# EAGLE design IR_detector_pcb (EAGLE 9.0.0)
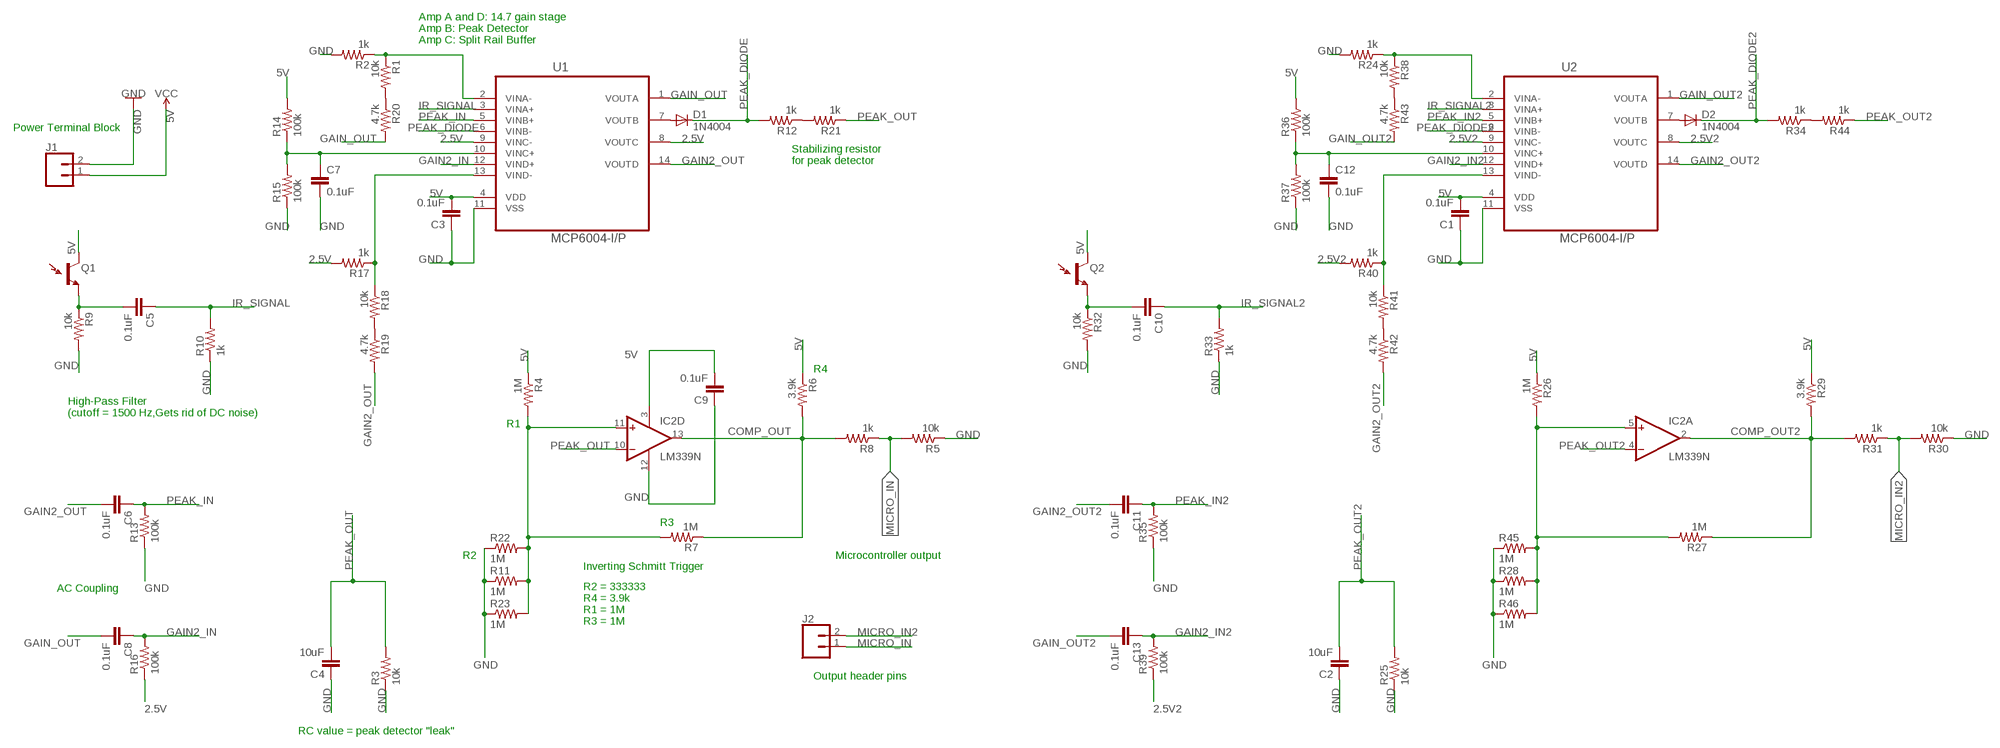
[diagram p0: schematic, sheet 1]

## Parts
C1  0.1uF  C-EU025-024X044  [C025-024X044]
C2  10uF  C-EU025-024X044  [C025-024X044]
C3  0.1uF  C-EU025-024X044  [C025-024X044]
C4  10uF  C-EU025-024X044  [C025-024X044]
C5  0.1uF  C-EU025-024X044  [C025-024X044]
C6  0.1uF  C-EU025-024X044  [C025-024X044]
C7  0.1uF  C-EU025-024X044  [C025-024X044]
C8  0.1uF  C-EU025-024X044  [C025-024X044]
C9  0.1uF  C-EU025-024X044  [C025-024X044]
C10  0.1uF  C-EU025-024X044  [C025-024X044]
C11  0.1uF  C-EU025-024X044  [C025-024X044]
C12  0.1uF  C-EU025-024X044  [C025-024X044]
C13  0.1uF  C-EU025-024X044  [C025-024X044]
D1  1N4004  [DO41-10]
D2  1N4004  [DO41-10]
IC2  LM339N  [DIL14]
J1  CONN_025MM  [SCREWTERMINAL-5MM-2]
J2  CONN_02  [1X02]
Q1  LTR-301  [LTR-301]
Q2  LTR-301  [LTR-301]
R1  10k  R-US_0204/2V  [0204V]
R2  1k  R-US_0204/2V  [0204V]
R3  10k  R-US_0204/2V  [0204V]
R4  1M  R-US_0204/2V  [0204V]
R5  10k  R-US_0204/2V  [0204V]
R6  3.9k  R-US_0204/2V  [0204V]
R7  1M  R-US_0204/2V  [0204V]
R8  1k  R-US_0204/2V  [0204V]
R9  10k  R-US_0204/2V  [0204V]
R10  1k  R-US_0204/2V  [0204V]
R11  1M  R-US_0204/2V  [0204V]
R12  1k  R-US_0204/2V  [0204V]
R13  100k  R-US_0204/2V  [0204V]
R14  100k  R-US_0204/2V  [0204V]
R15  100k  R-US_0204/2V  [0204V]
R16  100k  R-US_0204/2V  [0204V]
R17  1k  R-US_0204/2V  [0204V]
R18  10k  R-US_0204/2V  [0204V]
R19  4.7k  R-US_0204/2V  [0204V]
R20  4.7k  R-US_0204/2V  [0204V]
R21  1k  R-US_0204/2V  [0204V]
R22  1M  R-US_0204/2V  [0204V]
R23  1M  R-US_0204/2V  [0204V]
R24  1k  R-US_0204/2V  [0204V]
R25  10k  R-US_0204/2V  [0204V]
R26  1M  R-US_0204/2V  [0204V]
R27  1M  R-US_0204/2V  [0204V]
R28  1M  R-US_0204/2V  [0204V]
R29  3.9k  R-US_0204/2V  [0204V]
R30  10k  R-US_0204/2V  [0204V]
R31  1k  R-US_0204/2V  [0204V]
R32  10k  R-US_0204/2V  [0204V]
R33  1k  R-US_0204/2V  [0204V]
R34  1k  R-US_0204/2V  [0204V]
R35  100k  R-US_0204/2V  [0204V]
R36  100k  R-US_0204/2V  [0204V]
R37  100k  R-US_0204/2V  [0204V]
R38  10k  R-US_0204/2V  [0204V]
R39  100k  R-US_0204/2V  [0204V]
R40  1k  R-US_0204/2V  [0204V]
R41  10k  R-US_0204/2V  [0204V]
R42  4.7k  R-US_0204/2V  [0204V]
R43  4.7k  R-US_0204/2V  [0204V]
R44  1k  R-US_0204/2V  [0204V]
R45  1M  R-US_0204/2V  [0204V]
R46  1M  R-US_0204/2V  [0204V]
U1  MCP6004-I/P  [DIP254P762X533-14]
U2  MCP6004-I/P  [DIP254P762X533-14]

## Nets
2.5V: R16.1 R17.2 U1.8(VOUTC) U1.9(VINC-)
2.5V2: R39.1 R40.2 U2.8(VOUTC) U2.9(VINC-)
5V: C1.2 C3.2 C9.2 IC2.3(P:V+) J1.1 Q1.C(C1) Q2.C(C1) R4.1 R6.1 R14.2 R26.1 R29.1 R36.2 U1.4(VDD) U2.4(VDD) ; supply symbol labelled VCC
COMP_OUT: IC2.13(D:OUT) R6.2 R7.1 R8.2
COMP_OUT2: IC2.2(A:OUT) R27.1 R29.2 R31.2
GAIN2_IN: C8.1 R16.2 U1.12(VIND+)
GAIN2_IN2: C13.1 R39.2 U2.12(VIND+)
GAIN2_OUT: C6.2 R19.2 U1.14(VOUTD)
GAIN2_OUT2: C11.2 R42.2 U2.14(VOUTD)
GAIN_OUT: C8.2 R20.2 U1.1(VOUTA)
GAIN_OUT2: C13.2 R43.2 U2.1(VOUTA)
GND: C1.1 C2.1 C3.1 C4.1 C7.2 C9.1 C12.2 IC2.12(P:GND) J1.2 R2.2 R3.1 R5.1 R9.2 R10.1 R11.1 R13.1 R15.1 R22.1 R23.1 R24.2 R25.1 R28.1 R30.1 R32.2 R33.1 R35.1 R37.1 R45.1 R46.1 U1.11(VSS) U2.11(VSS)
IR_SIGNAL: C5.1 R10.2 U1.3(VINA+)
IR_SIGNAL2: C10.1 R33.2 U2.3(VINA+)
MICRO_IN: J2.1 R5.2 R8.1
MICRO_IN2: J2.2 R30.2 R31.1
N$1: C5.2 Q1.E(E1) R9.1
N$2: D1.A U1.7(VOUTB)
N$3: R17.1 R18.1 U1.13(VIND-)
N$4: C7.1 R14.1 R15.2 U1.10(VINC+)
N$5: R1.1 R2.1 U1.2(VINA-)
N$6: R18.2 R19.1
N$7: R1.2 R20.1
N$8: R12.1 R21.2
N$9: IC2.5(A:+IN) R26.2 R27.2 R28.2 R45.2 R46.2
N$10: C10.2 Q2.E(E1) R32.1
N$11: D2.A U2.7(VOUTB)
N$12: C12.1 R36.1 R37.2 U2.10(VINC+)
N$13: R24.1 R38.1 U2.2(VINA-)
N$14: R40.1 R41.1 U2.13(VIND-)
N$15: R41.2 R42.1
N$16: R38.2 R43.1
N$17: R34.1 R44.2
N$34: IC2.11(D:+IN) R4.2 R7.2 R11.2 R22.2 R23.2
PEAK_DIODE: D1.C R12.2 U1.6(VINB-)
PEAK_DIODE2: D2.C R34.2 U2.6(VINB-)
PEAK_IN: C6.1 R13.2 U1.5(VINB+)
PEAK_IN2: C11.1 R35.2 U2.5(VINB+)
PEAK_OUT: C4.2 IC2.10(D:-IN) R3.2 R21.1
PEAK_OUT2: C2.2 IC2.4(A:-IN) R25.2 R44.1
Unconnected: IC2.1(B:OUT) IC2.6(B:-IN) IC2.7(B:+IN) IC2.8(C:-IN) IC2.9(C:+IN) IC2.14(C:OUT)

## Notes on the sheet
- Amp A and D: 14.7 gain stage 
  Amp B: Peak Detector
  Amp C: Split Rail Buffer
- Power Terminal Block
- Stabilizing resistor 
  for peak detector
- R4
- High-Pass Filter
  (cutoff = 1500 Hz,Gets rid of DC noise)
- R1
- R3
- R2 | Microcontroller output
- Inverting Schmitt Trigger
- AC Coupling
- R2 = 333333
  R4 = 3.9k
  R1 = 1M
  R3 = 1M
- Output header pins
- RC value = peak detector "leak"

## Library data of the parts
C1-C13 = resistor:C-EU: CAPACITOR, European symbol
D1 D2 = diode:1N4004: DIODE general purpose rectifier, 1 A
IC2 = linear3:LM339: Low Power Low Offset Voltage Quad Comparators with open collector; LM139/LM239/LM339/LM2901/LM3302
J1 = SparkFun-Connectors:CONN_02: Multi connection point. Often used as Generic Header-pin footprint for 0.1 inch spaced/style header connections On any of the 0.1 inch spaced packages, you can populate with these: Break Away Headers - Straight <https://www.sparkfun.com/products/116> (PRT-00116) Break Away Male Headers - Right Angle <https://www.sparkfun.com/products/553> (PRT-00553) Female Headers <https://www.sparkfun.com/products/115> (PRT-00115) Break Away Headers - Machine Pin <https://www.sparkfun.com/products/117> (PRT-00117) Break Away Female Headers - Swiss Machine Pin <https://www.sparkfun.com/products/743> (PRT-00743) For SCREWTERMINALS and SPRING TERMINALS visit here: Screw Terimnals on SparkFun.com <https://www.sparkfun.com/search/results?term=Screw+Terminals> (5mm/3.5mm/2.54mm spacing) This device is also useful as a general connection point to wire up your design to another part of your project. Our various solder wires solder well into these plated through hole pads. Hook-Up Wire - Assortment (Stranded, 22 AWG) <https://www.sparkfun.com/products/11375> (PRT-11375) Hook-Up Wire - Assortment (Solid Core, 22 AWG) <https://www.sparkfun.com/products/11367> (PRT-11367) View the entire wire category on our website here <https://www.sparkfun.com/categories/141> Special notes: Molex polarized connector foot print use with: PRT-08233 with associated crimp pins and housings. 2.54_SCREWTERM for use with PRT-10571. 3.5mm Screw Terminal footprints for PRT-08084 5mm Screw Terminal footprints for use with PRT-08432; SF_SKU: PRT-08432
J2 = SparkFun-Connectors:CONN_02: Multi connection point. Often used as Generic Header-pin footprint for 0.1 inch spaced/style header connections On any of the 0.1 inch spaced packages, you can populate with these: Break Away Headers - Straight <https://www.sparkfun.com/products/116> (PRT-00116) Break Away Male Headers - Right Angle <https://www.sparkfun.com/products/553> (PRT-00553) Female Headers <https://www.sparkfun.com/products/115> (PRT-00115) Break Away Headers - Machine Pin <https://www.sparkfun.com/products/117> (PRT-00117) Break Away Female Headers - Swiss Machine Pin <https://www.sparkfun.com/products/743> (PRT-00743) For SCREWTERMINALS and SPRING TERMINALS visit here: Screw Terimnals on SparkFun.com <https://www.sparkfun.com/search/results?term=Screw+Terminals> (5mm/3.5mm/2.54mm spacing) This device is also useful as a general connection point to wire up your design to another part of your project. Our various solder wires solder well into these plated through hole pads. Hook-Up Wire - Assortment (Stranded, 22 AWG) <https://www.sparkfun.com/products/11375> (PRT-11375) Hook-Up Wire - Assortment (Solid Core, 22 AWG) <https://www.sparkfun.com/products/11367> (PRT-11367) View the entire wire category on our website here <https://www.sparkfun.com/categories/141> Special notes: Molex polarized connector foot print use with: PRT-08233 with associated crimp pins and housings. 2.54_SCREWTERM for use with PRT-10571. 3.5mm Screw Terminal footprints for PRT-08084 5mm Screw Terminal footprints for use with PRT-08432
Q1 Q2 = SparkFun-Sensors:LTR-301: LiteOn LTR-301 IR Phototransistor (Side-Receiving) Side-looking Infrared detectors. These simple devices operate at 940nm and work well for generic IR systems including remote control and touch-less object sensing. Using a simple ADC on any microcontroller will allow variable readings to be collected from the detector. Datasheet <http://www.sparkfun.com/datasheets/Components/LTR-301.pdf> SparkFun Products Infrared Emitters and Detectors <https://www.sparkfun.com/products/241> (SEN-00241); PROD_ID: DIO-10904; SF_ID: SEN-00241
R1-R46 = rcl:R-US_: RESISTOR, American symbol; SPICEPREFIX: R
U1 U2 = Microchip_By_element14_Batch_1:MCP6004-I/P: IC OPAMP QUAD 1.8V; MPN: MCP6004-I/P; OC_FARNELL: 1605571; OC_NEWARK: 61K2951; PACKAGE: 14DIP; SUPPLIER: Microchip

## Board
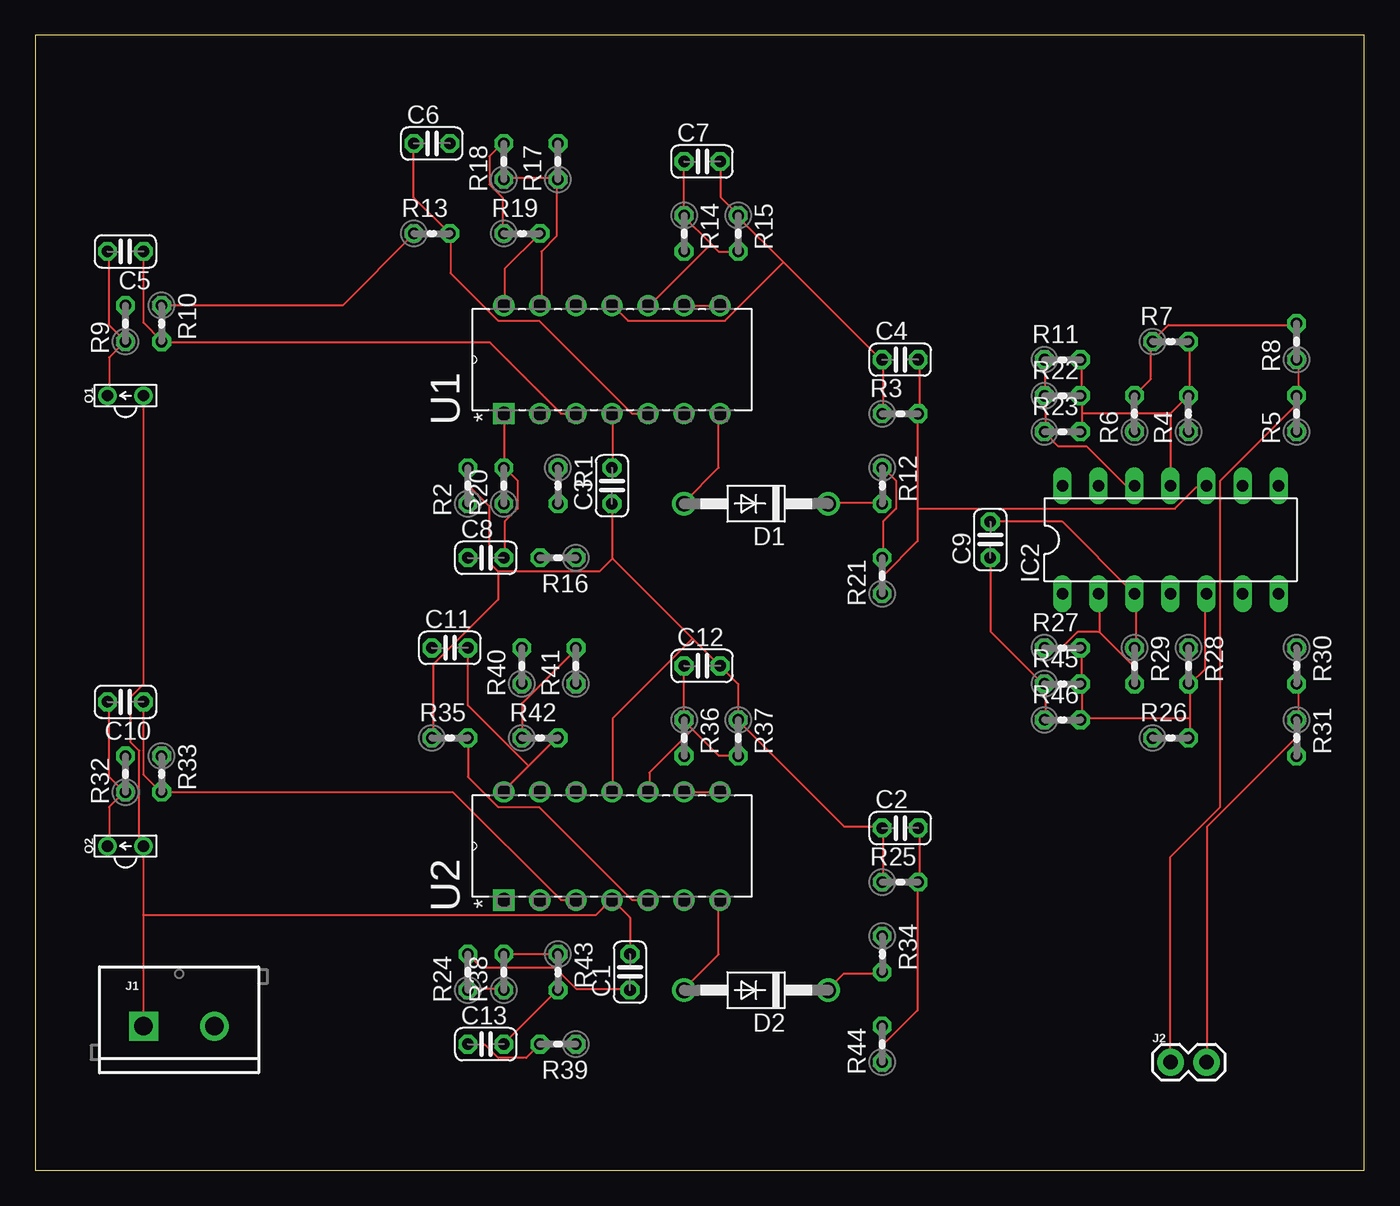
[diagram p1: board, top side]
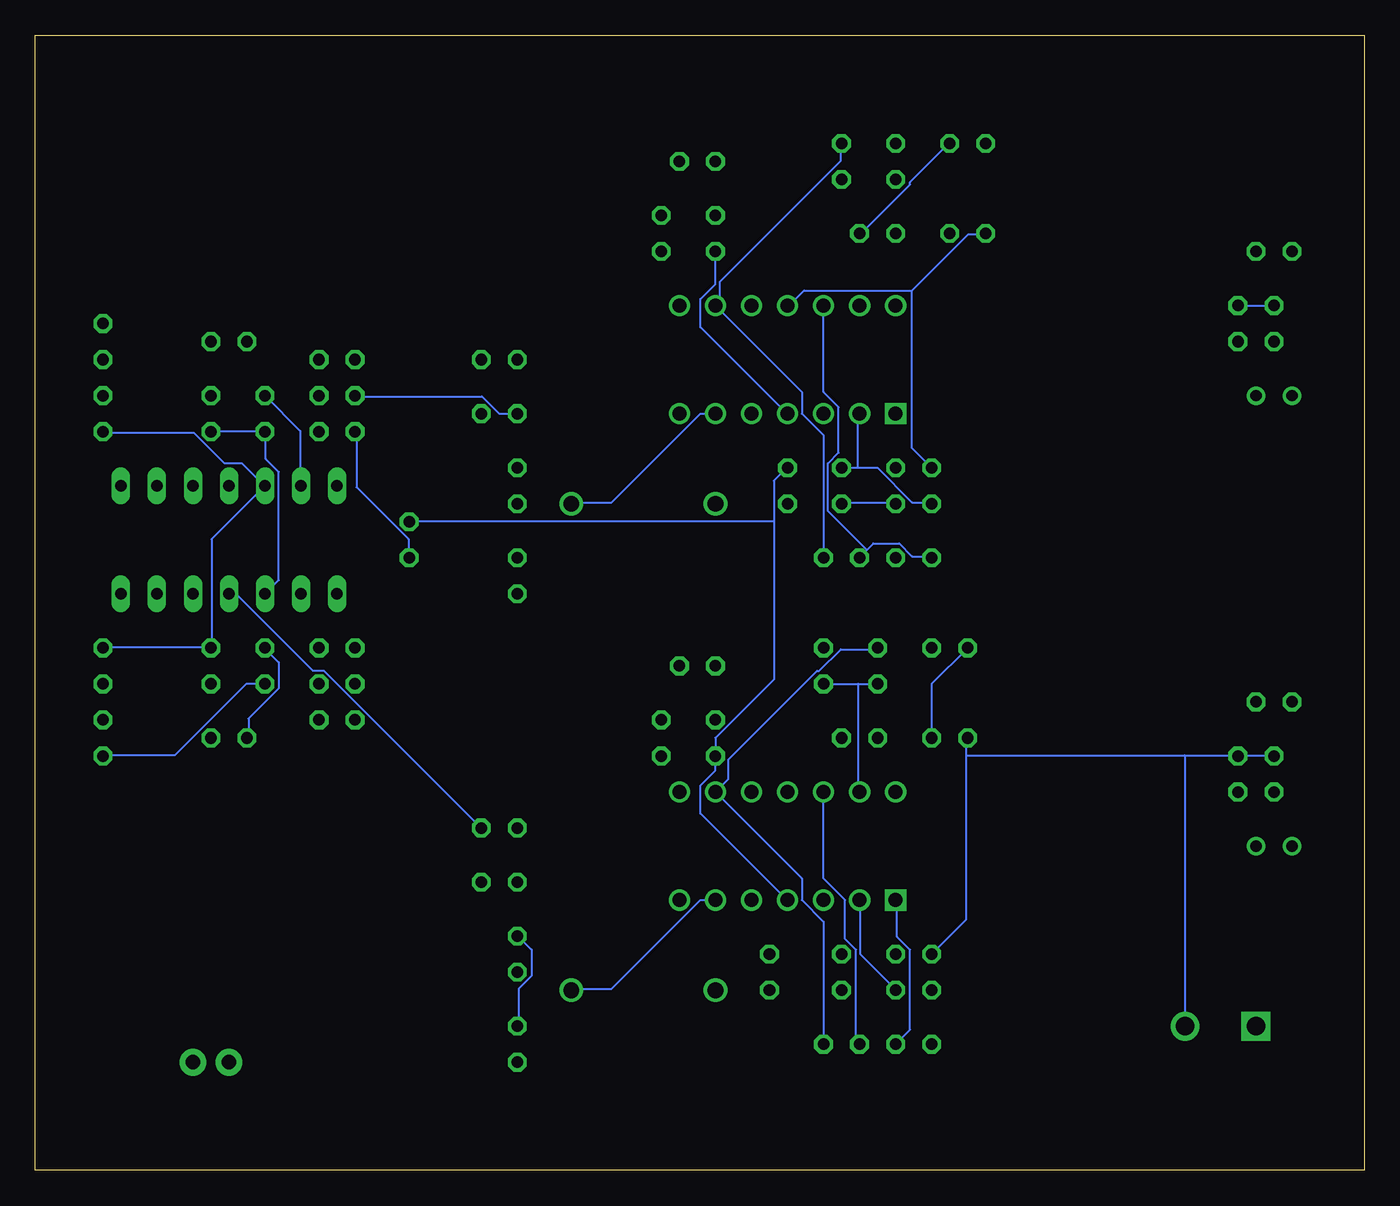
[diagram p2: board, bottom side, seen from below]

Size 93.65 x 80 mm. Coordinates in mm from the lower left corner, seen from the top.
Outline: 0,0 93.65,0 93.65,80 0,80 0,0
Copper layers (1*16): Top 0.035mm / dielectric 1.5mm / Bottom 0.035mm
Design rules "default": minimum track width 6mil, minimum drill 0.35mm, track to track 6mil, track to pad 6mil, pad to pad 6mil, via to via 6mil, smd to smd 6mil, copper to edge 40mil, drill to drill 6mil, minimum pad ring 10mil, minimum via ring 8mil, stop-mask expansion 4mil, vias tented up to drill 0mil, thermal gap 10mil

### Footprints (pad centres in the part's own frame; a part is rotated, then mirrored left to right if it is on the bottom)
C025-024X044 = drill 0.813 octagon: 1 -1.27,0; 2 1.27,0
DO41-10 = drill 1.118: A 5.08,0; C -5.08,0
DIL14 = drill 0.813 long: 1 -7.62,-3.81; 2 -5.08,-3.81; 3 -2.54,-3.81; 4 0,-3.81; 5 2.54,-3.81; 6 5.08,-3.81; 7 7.62,-3.81; 8 7.62,3.81; 9 5.08,3.81; 10 2.54,3.81; 11 0,3.81; 12 -2.54,3.81; 13 -5.08,3.81; 14 -7.62,3.81
SCREWTERMINAL-5MM-2 = drill 1.3 pad 2.032 square: 1 0,0 | drill 1.3 pad 2.032: 2 5,0
1X02 = drill 1.016 pad 1.88: 1 0,0; 2 2.54,0
LTR-301 = drill 0.8: C 1.27,0; E -1.27,0
0204V = drill 0.813 octagon: 1 -1.27,0; 2 1.27,0
DIP254P762X533-14 = drill 0.991 square: 1 -7.62,15.24 | drill 0.991: 2 -7.62,12.7; 3 -7.62,10.16; 4 -7.62,7.62; 5 -7.62,5.08; 6 -7.62,2.54; 7 -7.62,0; 8 0,0; 9 0,2.54; 10 0,5.08; 11 0,7.62; 12 0,10.16; 13 0,12.7; 14 0,15.24

### Placement (x,y rotation side)
C1  41.91,13.97 90 top
C2  60.96,24.13 0 top
C3  40.64,48.26 90 top
C4  60.96,57.15 0 top
C5  6.35,64.77 180 top
C6  27.94,72.39 0 top
C7  46.99,71.12 0 top
C8  31.75,43.18 0 top
C9  67.31,44.45 90 top
C10  6.35,33.02 180 top
C11  29.21,36.83 0 top
C12  46.99,35.56 0 top
C13  31.75,8.89 0 top
D1  50.8,46.99 180 top
D2  50.8,12.7 180 top
IC2  80.01,44.45 0 top
J1  7.62,10.16 0 top
J2  80.01,7.62 0 top
Q1  6.35,54.61 0 top
Q2  6.35,22.86 0 top
R1  36.83,48.26 270 top
R2  30.48,48.26 90 top
R3  60.96,53.34 0 top
R4  81.28,53.34 90 top
R5  88.9,53.34 90 top
R6  77.47,53.34 90 top
R7  80.01,58.42 0 top
R8  88.9,58.42 90 top
R9  6.35,59.69 90 top
R10  8.89,59.69 270 top
R11  72.39,57.15 0 top
R12  59.69,48.26 270 top
R13  27.94,66.04 0 top
R14  45.72,66.04 270 top
R15  49.53,66.04 270 top
R16  36.83,43.18 180 top
R17  36.83,71.12 90 top
R18  33.02,71.12 90 top
R19  34.29,66.04 0 top
R20  33.02,48.26 90 top
R21  59.69,41.91 90 top
R22  72.39,54.61 0 top
R23  72.39,52.07 0 top
R24  30.48,13.97 90 top
R25  60.96,20.32 0 top
R26  80.01,30.48 0 top
R27  72.39,36.83 0 top
R28  81.28,35.56 270 top
R29  77.47,35.56 270 top
R30  88.9,35.56 270 top
R31  88.9,30.48 270 top
R32  6.35,27.94 90 top
R33  8.89,27.94 270 top
R34  59.69,15.24 270 top
R35  29.21,30.48 0 top
R36  45.72,30.48 270 top
R37  49.53,30.48 270 top
R38  33.02,13.97 90 top
R39  36.83,8.89 180 top
R40  34.29,35.56 90 top
R41  38.1,35.56 90 top
R42  35.56,30.48 0 top
R43  36.83,13.97 270 top
R44  59.69,8.89 90 top
R45  72.39,34.29 0 top
R46  72.39,31.75 0 top
U1  48.26,60.96 90 top
U2  48.26,26.67 90 top

### Tracks (layer width: path | path; a pad name or v marks a point on that pad's centre or on a via)
2.5V
  Top 0.152: U1.9 U1.8
  Bottom 0.152: R16.1 38.1,51.82 39.62,53.34 39.62,54.86 U1.9 45.41,61.27 45.41,62.64 36.88,71.17 36.88,72.39 R17.2
2.5V2
  Top 0.152: U2.9 U2.8
  Bottom 0.152: R39.1 38.1,17.53 39.62,19.05 39.62,20.57 U2.9 44.81,27.58 44.81,28.96 38.56,35.2 38.41,35.2 36.88,36.73 34.29,36.73 R40.2
5V
  Top 0.152: J1.1 7.62,17.98 | 7.62,17.98 Q2.C 7.32,23.16 7.32,29.57 6.71,30.18 6.71,33.38 7.62,34.29 Q1.C | R29.1 77.57,36.88 77.57,40.54 IC2.3 72.39,45.72 C9.2 | C1.2 41.91,17.83 40.69,19.05 U2.4 40.54,19.05 39.47,17.98 7.62,17.98 | C3.2 40.69,49.53 40.69,53.34 U1.4
  Bottom 0.152: R4.1 81.23,52.12 77.57,52.12 R6.1 77.42,51.97 77.42,50.14 76.5,49.23 76.5,41.6 IC2.3 | R26.1 78.64,30.48 78.64,31.85 76.5,33.98 76.5,35.81 77.42,36.73 R29.1 | U2.4 40.69,19.05 46.79,25.15 46.79,27.13 45.72,28.19 R36.2 45.72,30.48 41.6,34.59 41.6,45.72 | R14.2 45.72,62.48 46.79,61.42 46.79,59.44 40.69,53.34 U1.4 | 41.6,45.72 41.6,48.62 40.69,49.53 C3.2 | 41.6,45.72 C9.2
COMP_OUT
  Top 0.152: R6.2 78.64,55.78 78.64,58.37 R7.1 78.79,58.52 79.86,59.59 88.85,59.59 R8.2
  Bottom 0.152: R6.2 74.98,52.12 74.98,48.31 IC2.13
COMP_OUT2
  Top 0.152: 74.98,37.95 77.42,35.51 77.42,34.29 R29.2 | 74.98,37.95 74.98,40.54 IC2.2 | 74.98,37.95 73.46,37.95 72.39,36.88 71.17,36.88 R27.1
  Bottom 0.152: R29.2 78.79,34.29 83.82,29.26 88.85,29.26 R31.2
GAIN2_IN
  Bottom 0.152: 35.05,43.74 35.51,43.28 R16.2 | 35.05,43.74 34.59,44.2 32.77,44.2 31.85,43.28 30.48,43.28 C8.1 | U1.12 38.1,54.86 37.03,53.8 37.03,50.6 37.8,49.84 37.8,46.48 35.05,43.74
GAIN2_IN2
  Top 0.152: R39.2 34.59,7.92 32.61,7.92 31.7,8.84 30.48,8.84 C13.1
  Bottom 0.152: U2.12 38.1,20.57 36.58,19.05 36.58,16.31 35.81,15.54 35.81,9.14 R39.2
GAIN2_OUT
  Top 0.152: R19.2 33.07,63.55 33.07,60.96 U1.14
  Bottom 0.152: C6.2 29.26,72.39 32,69.65 32,69.49 35.51,65.99 R19.2
GAIN2_OUT2
  Top 0.152: 34.75,28.5 32.92,26.67 U2.14 | 34.75,28.5 36.73,30.48 R42.2 | C11.2 30.48,32.77 34.75,28.5
GAIN_OUT
  Top 0.152: 33.07,49.53 33.98,48.62 33.98,46.63 33.07,45.72 33.07,43.28 C8.2 | 33.07,49.53 33.07,53.34 U1.1 | 33.07,49.53 R20.2
GAIN_OUT2
  Top 0.152: C13.2 33.07,8.99 36.73,12.65 R43.2
  Bottom 0.152: C13.2 32,9.91 32,15.54 32.92,16.46 32.92,19.05 U2.1
GND
  Top 0.152: R46.1 71.17,31.85 71.17,34.29 R45.1 71.02,34.29 67.36,37.95 67.36,43.13 C9.1 | C7.2 48.31,71.02 48.31,68.58 49.53,67.36 R15.1 49.53,67.21 52.73,64.01 | R3.1 59.74,53.34 59.74,57.15 C4.1 59.59,57.15 52.73,64.01 | IC2.12 77.42,48.31 76.81,48.31 74.07,51.05 72.08,51.05 71.17,51.97 R23.1 71.17,52.12 71.17,54.56 R22.1 71.17,54.71 71.17,57.15 R11.1 | R24.2 31.39,14.33 36.58,14.33 38.1,12.8 41.91,12.8 C1.1 | R10.1 21.64,60.96 26.67,65.99 R13.1 | R25.1 59.74,20.42 59.74,24.08 C2.1 59.59,24.23 57,24.23 49.53,31.7 R37.1 49.53,34.29 C12.2 46.33,37.49 | 40.69,43.13 40.69,46.94 C3.1 | 46.33,37.49 40.69,43.13 | R2.2 30.48,48.31 32,46.79 32,42.82 32.61,42.22 | 32.61,42.22 39.78,42.22 40.69,43.13 | 46.33,37.49 40.69,31.85 40.69,26.67 U2.11 | 32.61,42.22 32.61,40.23 28.04,35.66 28.04,30.48 R35.1 | 52.73,64.01 48.62,59.89 41.76,59.89 40.69,60.96 U1.11
  Bottom 0.152: R30.1 88.85,36.88 81.38,36.88 R28.1 81.23,36.88 81.23,44.5 IC2.12 77.57,48.31 79.1,49.84 80.31,49.84 82.45,51.97 88.85,51.97 R5.1 | R3.1 60.96,53.34 62.18,54.56 71.02,54.56 R22.1 | C9.1 67.36,43.28 67.36,44.5 71.02,48.16 71.02,51.97 R23.1 | R32.2 6.4,29.26 8.84,29.26 R33.1 8.99,29.26 12.65,29.26 | 28.04,29.26 28.04,17.68 R24.2 | 28.04,29.26 28.04,30.48 R35.1 | 28.04,29.26 12.65,29.26 | 12.65,29.26 12.65,10.21 J1.2 | R10.1 R9.2 | 31.85,62.03 27.89,65.99 26.67,65.99 R13.1 | 31.85,62.03 39.47,62.03 40.54,60.96 U1.11 | 31.85,62.03 31.85,50.9 R2.2
IR_SIGNAL
  Top 0.152: C5.1 7.62,59.74 8.84,58.52 R10.2 8.99,58.37 32,58.37 37.03,53.34 U1.3
IR_SIGNAL2
  Top 0.152: C10.1 7.62,27.89 8.84,26.67 R33.2 29.41,26.67 37.03,19.05 U2.3
MICRO_IN
  Top 0.152: R8.1 89,57.15 89,54.71 R5.2 88.85,54.56 88.85,53.95 83.52,48.62 83.52,25.6 80.01,22.1 J2.1
MICRO_IN2
  Top 0.152: R30.2 89,34.29 89,31.85 R31.1 88.85,31.7 88.85,30.48 82.6,24.23 82.6,7.62 J2.2
N$1
  Top 0.152: Q1.E 5.18,54.71 5.18,57.3 6.25,58.37 R9.1 5.18,59.59 5.18,64.77 C5.2
N$2
  Top 0.152: U1.7 48.16,53.34 48.16,49.53 45.72,47.09 D1.A
N$3
  Top 0.152: R18.1 33.07,69.95 36.73,69.95 R17.1 36.73,69.8 36.73,65.84 35.66,64.77 35.66,60.96 U1.13
N$4
  Top 0.152: R15.2 48.16,64.77 47.55,65.38 | 47.55,65.38 45.72,67.21 R14.1 C7.1 | 47.55,65.38 47.55,65.23 43.28,60.96 U1.10
N$5
  Bottom 0.152: R1.1 35.66,49.53 | 35.66,49.53 34.29,49.53 31.85,47.09 30.48,47.09 R2.1 | 35.66,49.53 35.66,53.34 U1.2
N$6
  Top 0.152: R19.1 32.92,66.14 32.92,68.58 32,69.49 32,71.48 32.92,72.39 R18.2
N$7
  Bottom 0.152: R20.1 33.07,47.09 36.73,47.09 R1.2
N$8
  Top 0.152: R21.2 59.74,43.28 59.74,45.72 60.66,46.63 60.66,48.62 59.74,49.53 R12.1
N$9
  Top 0.152: 73.76,34.29 73.76,31.85 | 73.76,34.29 73.76,36.73 R27.2 | 73.76,34.29 R45.2 | 81.38,34.29 81.38,31.85 | 81.38,31.85 81.38,30.48 R26.2 | 81.38,34.29 82.45,35.36 82.45,40.54 IC2.5 | 81.38,34.29 R28.2 | 81.38,31.85 73.76,31.85 | 73.76,31.85 R46.2
N$10
  Top 0.152: 6.25,26.67 5.18,25.6 5.18,22.86 Q2.E | 6.25,26.67 5.18,27.74 5.18,32.92 C10.2 | 6.25,26.67 R32.1
N$11
  Top 0.152: U2.7 48.16,19.05 48.16,15.24 45.72,12.8 D2.A
N$12
  Top 0.152: 46.33,31.09 45.72,31.7 R36.1 C12.1 | 46.33,31.09 48.16,29.26 49.53,29.26 R37.2 | 46.33,31.09 43.28,28.04 43.28,26.67 U2.10
N$13
  Top 0.152: R24.1 30.48,12.8 32.92,12.8 R38.1
  Bottom 0.152: U2.2 35.51,19.05 35.51,15.24 33.07,12.8 R38.1
N$14
  Bottom 0.152: R41.1 35.66,34.29 | 35.66,34.29 R40.1 | 35.66,34.29 35.66,26.67 U2.13
N$15
  Top 0.152: R42.1 34.29,32.92 38.1,36.73 R41.2
N$16
  Top 0.152: R43.1 R38.2
N$17
  Bottom 0.152: R44.2 59.59,10.21 59.59,12.8 58.67,13.72 58.67,15.54 59.59,16.46 R34.1
N$34
  Top 0.152: 73.76,53.34 73.76,54.56 R22.2 73.76,54.71 73.76,57.15 R11.2 | 73.76,53.34 73.76,52.12 R23.2 | 80.01,53.34 IC2.11 | 80.01,53.34 R4.2 81.38,54.71 81.38,58.37 R7.2 | 80.01,53.34 73.76,53.34
PEAK_DIODE
  Top 0.152: R12.2 59.59,47.09 55.93,47.09 D1.C
  Bottom 0.152: U1.6 46.79,53.34 53.03,47.09 55.78,47.09 D1.C
PEAK_DIODE2
  Top 0.152: R34.2 59.59,13.87 57,13.87 55.93,12.8 D2.C
  Bottom 0.152: U2.6 46.79,19.05 53.03,12.8 55.78,12.8 D2.C
PEAK_IN
  Top 0.152: C6.1 26.67,68.58 R13.2 29.26,65.99 29.26,63.25 32.61,59.89 35.51,59.89 42.06,53.34 U1.5
PEAK_IN2
  Top 0.152: U2.5 42.06,19.05 35.51,25.6 32.61,25.6 30.48,27.74 R35.2
  Bottom 0.152: R35.2 30.48,34.29 C11.1
PEAK_OUT
  Top 0.152: 62.18,46.63 62.18,53.34 R3.2 62.33,53.34 62.33,57.15 C4.2 | 62.18,46.63 62.18,44.35 59.74,41.91 59.74,40.69 R21.1 | 62.18,46.63 80.31,46.63 81.84,48.16 82.45,48.16 IC2.10
PEAK_OUT2
  Top 0.152: R44.1 59.74,7.62 59.74,8.84 62.18,11.28 62.18,20.27 R25.2 62.33,20.42 62.33,24.08 C2.2
  Bottom 0.152: C2.2 73.3,35.2 74.07,35.2 79.4,40.54 80.01,40.54 IC2.4